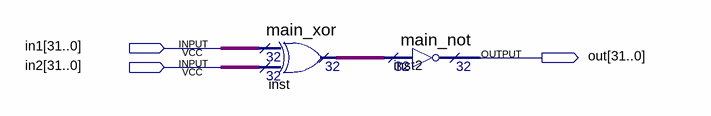
[diagram p0: schematic sheet]
// Quartus schematic xnor.bdf as structural Verilog: 2 symbols, 3 pins
module \xnor  (
  input  [31:0] in1,
  input  [31:0] in2,
  output [31:0] out
);

  wire [31:0] inst_result;

  main_xor inst (.data0x(in1), .data1x(in2), .result(inst_result));
  main_not inst2 (.data(inst_result), .result(out));
endmodule
